# EAGLE design ai_breakout_microusb (EAGLE 6.5.0)
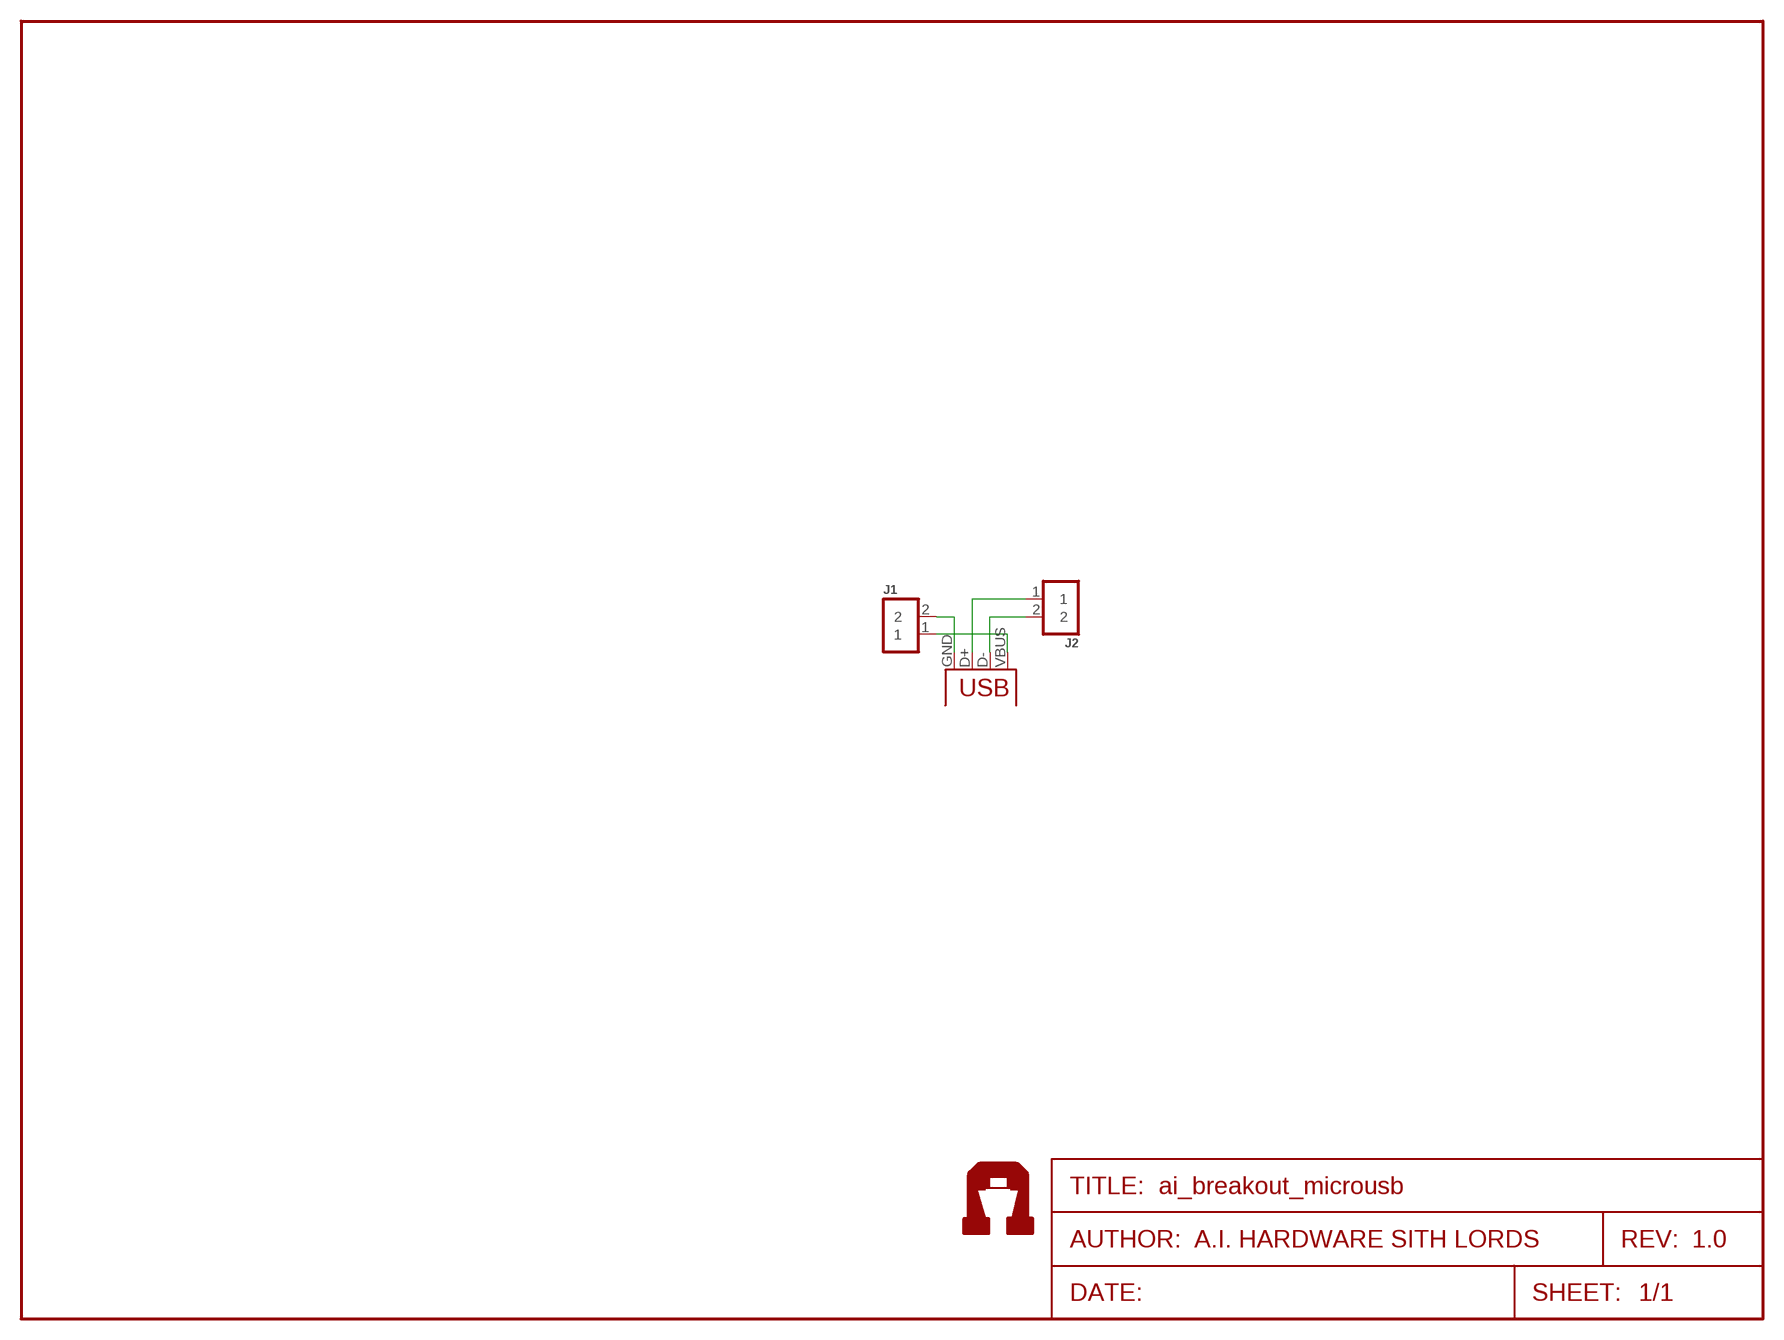
[diagram p0: schematic, sheet 1]
FRAME1 (FRAME-LETTER): AUTHOR: A.I. HARDWARE SITH LORDS; REV: 1.0

## Parts
J1  1X02  [1X02]
J2  1X02NOFIRST  [1X02-NOFIRST]
U$2  AI-LOGOXS  [AI-LOGO-XS]
USB1  USBMICROB-TH  [USB-MICROB-TH]

## Nets
D+: J2.1 USB1.D+
D-: J2.2 USB1.D-
GND: J1.2 USB1.GND
VBUS: J1.1 USB1.VBUS

## Library data of the parts
J1 J2 = Ai_Connectors:1X02
U$2 = Ai_Miscellany:AI-LOGO
USB1 = Ai_Connectors:USB

## Board
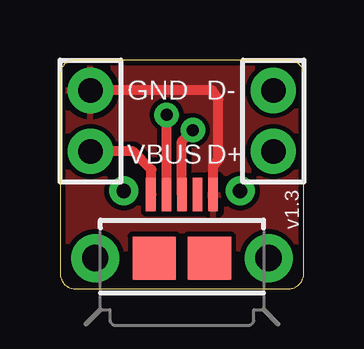
[diagram p1: board, top side]
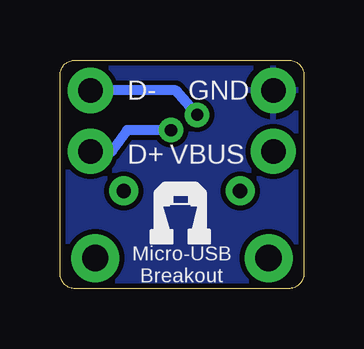
[diagram p2: board, bottom side, seen from below]

Size 10.16 x 9.53 mm. Coordinates in mm from the lower left corner, seen from the top.
Outline: 0.64,0 9.53,0 arc90 10.16,0.64 10.16,8.89 arc90 9.53,9.53 0.64,9.53 arc90 0,8.89 0,0.64 arc90 0.64,0
Copper layers (1*16): Top 0.035mm / dielectric 1.5mm / Bottom 0.035mm
Design rules "ai_2layer": minimum track width 7mil, minimum drill 15mil, track to track 8mil, track to pad 8mil, pad to pad 8mil, via to via 8mil, smd to smd 8mil, copper to edge 8mil, drill to drill 8mil, minimum pad ring 12mil, minimum via ring 10mil, stop-mask expansion 4mil, vias tented up to drill 20mil, thermal gap 10mil

### Footprints (pad centres in the part's own frame; a part is rotated, then mirrored left to right if it is on the bottom)
1X02 = drill 1.016 pad 1.88: 1 -1.27,0; 2 1.27,0
1X02-NOFIRST = drill 1.016 pad 1.88: 1 -1.27,0; 2 1.27,0
USB-MICROB-TH = smd 0.4 x 1.4: D+ 0,2.65; D- -0.65,2.65; GND 1.3,2.65; ID 0.65,2.65; VBUS -1.3,2.65 | smd 1.8 x 1.8: M5 -1.15,0; M6 1.15,0 | drill 0.6 pad 1.2: MT1 -2.425,2.8; MT2 2.425,2.8 | drill 1.1 pad 2: MT3 -3.61,0; MT4 3.61,0

### Placement (x,y rotation side)
J1  1.27,6.99 90 top
J2  8.89,6.99 90 top
U$2  6.48,1.78 0 bottom
USB1  5.08,1.27 0 top

### Tracks (layer width: path | path; a pad name or v marks a point on that pad's centre or on a via)
D+  (via drill 0.51)
  Top 0.406: USB1.D+ 5.08,6.15 v5.54,6.6
  Bottom 0.406: v5.54,6.6 7.37,6.6 8,5.71 J2.1
D-  (via drill 0.51)
  Top 0.406: USB1.D- 4.45,3.94 v4.45,7.24
  Bottom 0.406: v4.45,7.24 5.33,8.26 J2.2
GND
  Top 0.406: J1.2 6.35,8.26 6.6,7.87 6.6,5.36 6.38,5.13 USB1.GND
  pour Bottom: 10.16,0 10.16,9.53 0,9.53 0,0
  pour Top: 10.16,0 10.16,9.53 0,9.53 0,0
VBUS
  Top 0.406: USB1.VBUS 3.81,3.92 3.81,4.95 3.05,5.71 J1.1

### Text on the board
tNames: GND | D- | VBUS | D+ | v1.3
bNames: GND | D- | VBUS | D+ | Micro-USB / Breakout